# Altium schematic sheet MosFetsDrive_2_1.SchDoc
size A4; SheetNumber: 1; SheetTotal: 7
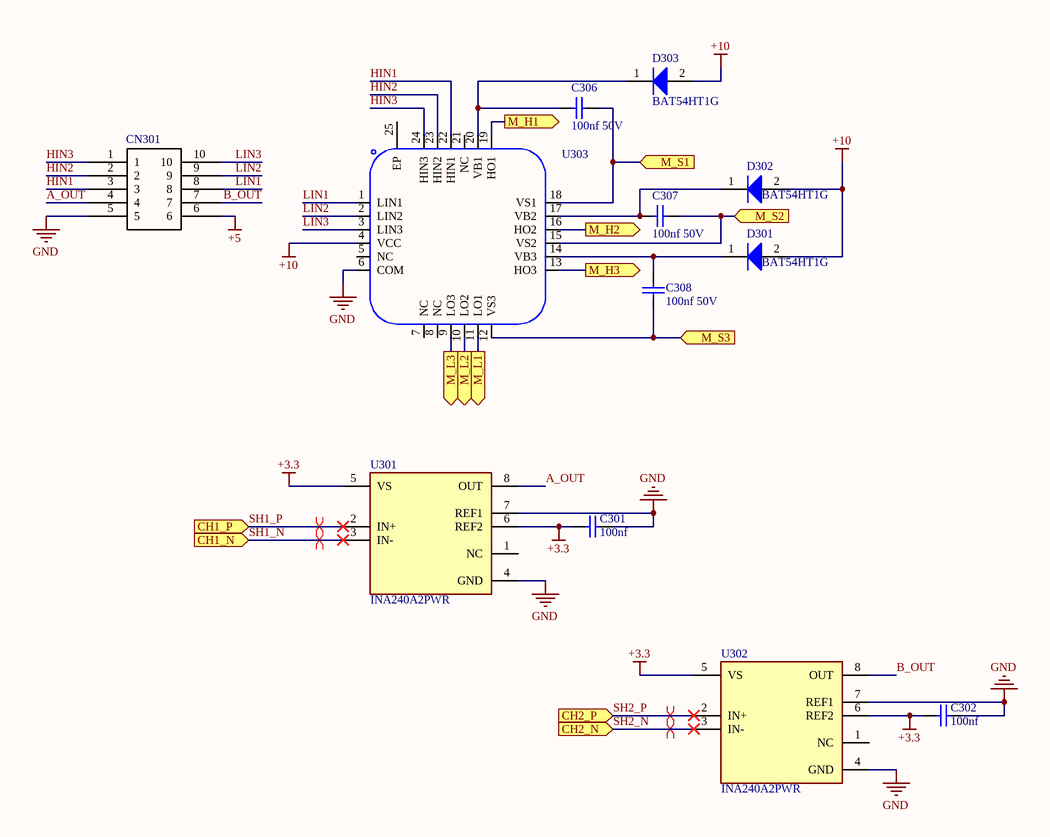
[diagram p0: MosFetsDrive_2_1.SchDoc]

## Parts
C301  100nf  [CAPC1608X90X35ML10T15]
C302  100nf  [CAPC1608X90X35ML10T15]
C306  100nf 50V  [CAPC1005X60X30ML05T10]
C307  100nf 50V  [CAPC1005X60X30ML05T10]
C308  100nf 50V  [CAPC1005X60X30ML05T10]
CN301  (no value)  [2X10Pin]
D301  BAT54HT1G  [ONSC-SOD-323-2-477-02_V]
D302  BAT54HT1G  [ONSC-SOD-323-2-477-02_V]
D303  BAT54HT1G  [ONSC-SOD-323-2-477-02_V]
U301  INA240A2PWR  [FP-PW0008A-MFG]
U302  INA240A2PWR  [FP-PW0008A-MFG]
U303  FD6288Q  [QFN-24_L4.0-W4.0-P0.50-BL-EP2.6]  (value not drawn)

## Ports
CH1_N (in), CH1_P (in), CH2_N (in), CH2_P (in), M_H1 (out), M_H2 (out), M_H3 (out), M_L1 (out), M_L2 (out), M_L3 (out), M_S1 (in), M_S2 (in), M_S3 (in)

## Nets
+3.3: C301.2 C302.2 U301.5(VS) U301.6(REF2) U302.5(VS) U302.6(REF2)
+5: CN301.6
+10: D301.2(A) D302.2(A) D303.2(A) U303.4(VCC)
GND: C301.1 C302.1 CN301.5 U301.4(GND) U301.7(REF1) U302.4(GND) U302.7(REF1) U303.6(COM)
A_OUT: CN301.4 U301.8(OUT)
B_OUT: CN301.7 U302.8(OUT)
HIN1: CN301.3 U303.22(HIN1)
HIN2: CN301.2 U303.23(HIN2)
HIN3: CN301.1 U303.24(HIN3)
LIN1: CN301.8 U303.1(LIN1)
LIN2: CN301.9 U303.2(LIN2)
LIN3: CN301.10 U303.3(LIN3)
M_H1: U303.19(HO1) ; port M_H1
M_H2: U303.16(HO2) ; port M_H2
M_H3: U303.13(HO3) ; port M_H3
M_L1: U303.11(LO1) ; port M_L1
M_L2: U303.10(LO2) ; port M_L2
M_L3: U303.9(LO3) ; port M_L3
M_S1: C306.2 U303.18(VS1) ; port M_S1
M_S2: C307.2 U303.15(VS2) ; port M_S2
M_S3: C308.1 U303.12(VS3) ; port M_S3
SH1_N: U301.3(IN-) ; port CH1_N
SH1_P: U301.2(IN+) ; port CH1_P
SH2_N: U302.3(IN-) ; port CH2_N
SH2_P: U302.2(IN+) ; port CH2_P
NetC306_1: C306.1 D303.1(K) U303.20(VB1)
NetC307_1: C307.1 D302.1(K) U303.17(VB2)
NetC308_2: C308.2 D301.1(K) U303.14(VB3)

Not connected (* = marked no-connect by the designer): U301 1(NC); U302 1(NC); U303 5(NC) 7(NC) 8(NC) 21(NC) 25(EP)

## Layout directives
differential pair: SH1_N, SH1_P, SH2_N, SH2_P

## Library data of the parts
C301 C302 = CMP-2100-03642-1: Chip Capacitor, 10 nF, +/- 10%, 50 V, -55 to 125 degC, 0603 (1608 Metric), RoHS, Tape and Reel; Manufacturer: Murata; Insulation Resistance: 10GR; Dielectric: X7R; Voltage Rating: 50V; Capacitance: 10nF; Material: Ceramic; Package Quantity: 1; Lead Free: LeadFree; Case/Package: 0603; Termination: SMD/SMT; REACH SVHC: Unknown; Manufacturer URL: http://www.murata.com/; Datasheet URL: http://search.murata.co.jp/Ceramy/image/img/A01X/G101/ENG/GRM188R71H103KA01-01.pdf; Mount: SurfaceMount; Datasheet Version: 42401.0; Number of Pins: 2; Length: 1.6mm; Voltage: 50V; Depth: 0.8mm; Tolerance: 10%; Min Operating Temperature: -55degC; Voltage Rating (DC): 50V; Max Operating Temperature: 125degC; Package Description: 2-Pin Surface Mount Device, Body 1.6 x 0.8 mm; RoHSCompliant: True; Case Code (Imperial): 0603; Width: 0.031inch; Case Code (Metric): 1608; Height: 0.8mm; Package Reference: 0603; Packaging: TapeandReel; Thickness: 0.035inch; Dielectric Material: Ceramic
C306-C308 = CMP-2008-02046-1: Manufacturer: Kemet; Part Number: C0402C104K8PACTU
CN301 = Component_1
D301-D303 = CMP-1055-00462-1: Schottky Barrier Diode, 2-Pin SOD-323, Pb-Free, Tape and Reel; Manufacturer: On Semiconductor; Configuration: Single; trr Max (ns): 5; IFSM Max (A): 0.6; ComponentLink3URL: http://www.onsemi.com/pub_link/Collateral/477-02.PDF.1; PackageDescription: 2-Pin SOD, Body 1.7 x 1.25 mm; ComponentLink2URL: http://www.onsemi.cn/pub_link/Collateral/BAT54HT1-D.PDF; ComponentLink3Description: Package Specification; ComponentLink2Description: Datasheet; DatasheetVersion: Rev. 6; PackageReference: SOD-323-2-477-02; RoHS: TRUE; ComponentLink1URL: http://www.onsemi.com/; Packing: Tape and Reel; PartNumber: BAT54HT1G; Mounting Technology: Surface Mount; ComponentLink1Description: Manufacturer URL; PackageVersion: Rev. H, 03/2007
U301 U302 = CMP-04895-000047-1: IC AMP CURRENT SENSE 8-TSSOP; Manufacturer: Texas Instruments; Voltage Gain: 0.05V/mV; Max Supply Voltage: 5.5V; Max Junction Temp: +150°C; Input Offset Voltage: 0.005mV; Bandwidth: 400kHz; Min Supply Voltage: 2.7V; Nominal Supply Current: 1.8mA; Standoff Height: 0.05mm; Number Of Channels: 1; Input Bias Current: 90uA; ComponentLink2URL: http://www.ti.com/lit/ds/symlink/ina240.pdf; Device Class L2: Linear ICs; ComponentLink2Description: Datasheet; Temperature: -40°C to +125°C; Octopart: https://octopart.com/ina240a2pwr-texas+instruments-75431049; Automotive: No; Manufacturer Part Number: INA240A2PWR; Ambient Temperature Range Low: -40°C; RoHS: TRUE; Package: PW0008A; Device Class L1: Integrated Circuits (ICs); Temperature Range Low: -40°C; Category: IC; Ipc Land Pattern Name: SOP65P300X120-8; Temperature Range High: +125°C; Ambient Temperature Range High: +125°C; Height: 1.2mm; Lead Free: Yes; Device Class L3: Instrumentation; Digikey Description: IC AMP CURRENT SENSE 8-TSSOP
U303 = FD6288Q: Manufacturer: Fortior Tech(峰岹); Symbol: FD6288Q_C328453; Add into BOM: yes; Device: FD6288Q; LCSC Part Name: FD6288Q; Supplier Part: C328453; Manufacturer Part: FD6288Q; Supplier Footprint: QFN-24; JLCPCB Part Class: Extended Part; Datasheet: https://atta.szlcsc.com/upload/public/pdf/source/20181108/C328453_785547738DB9FC0123219FC22539EFAD.pdf; Supplier: LCSC; Convert to PCB: yes